# Altium schematic sheet Comms.SchDoc
size A3
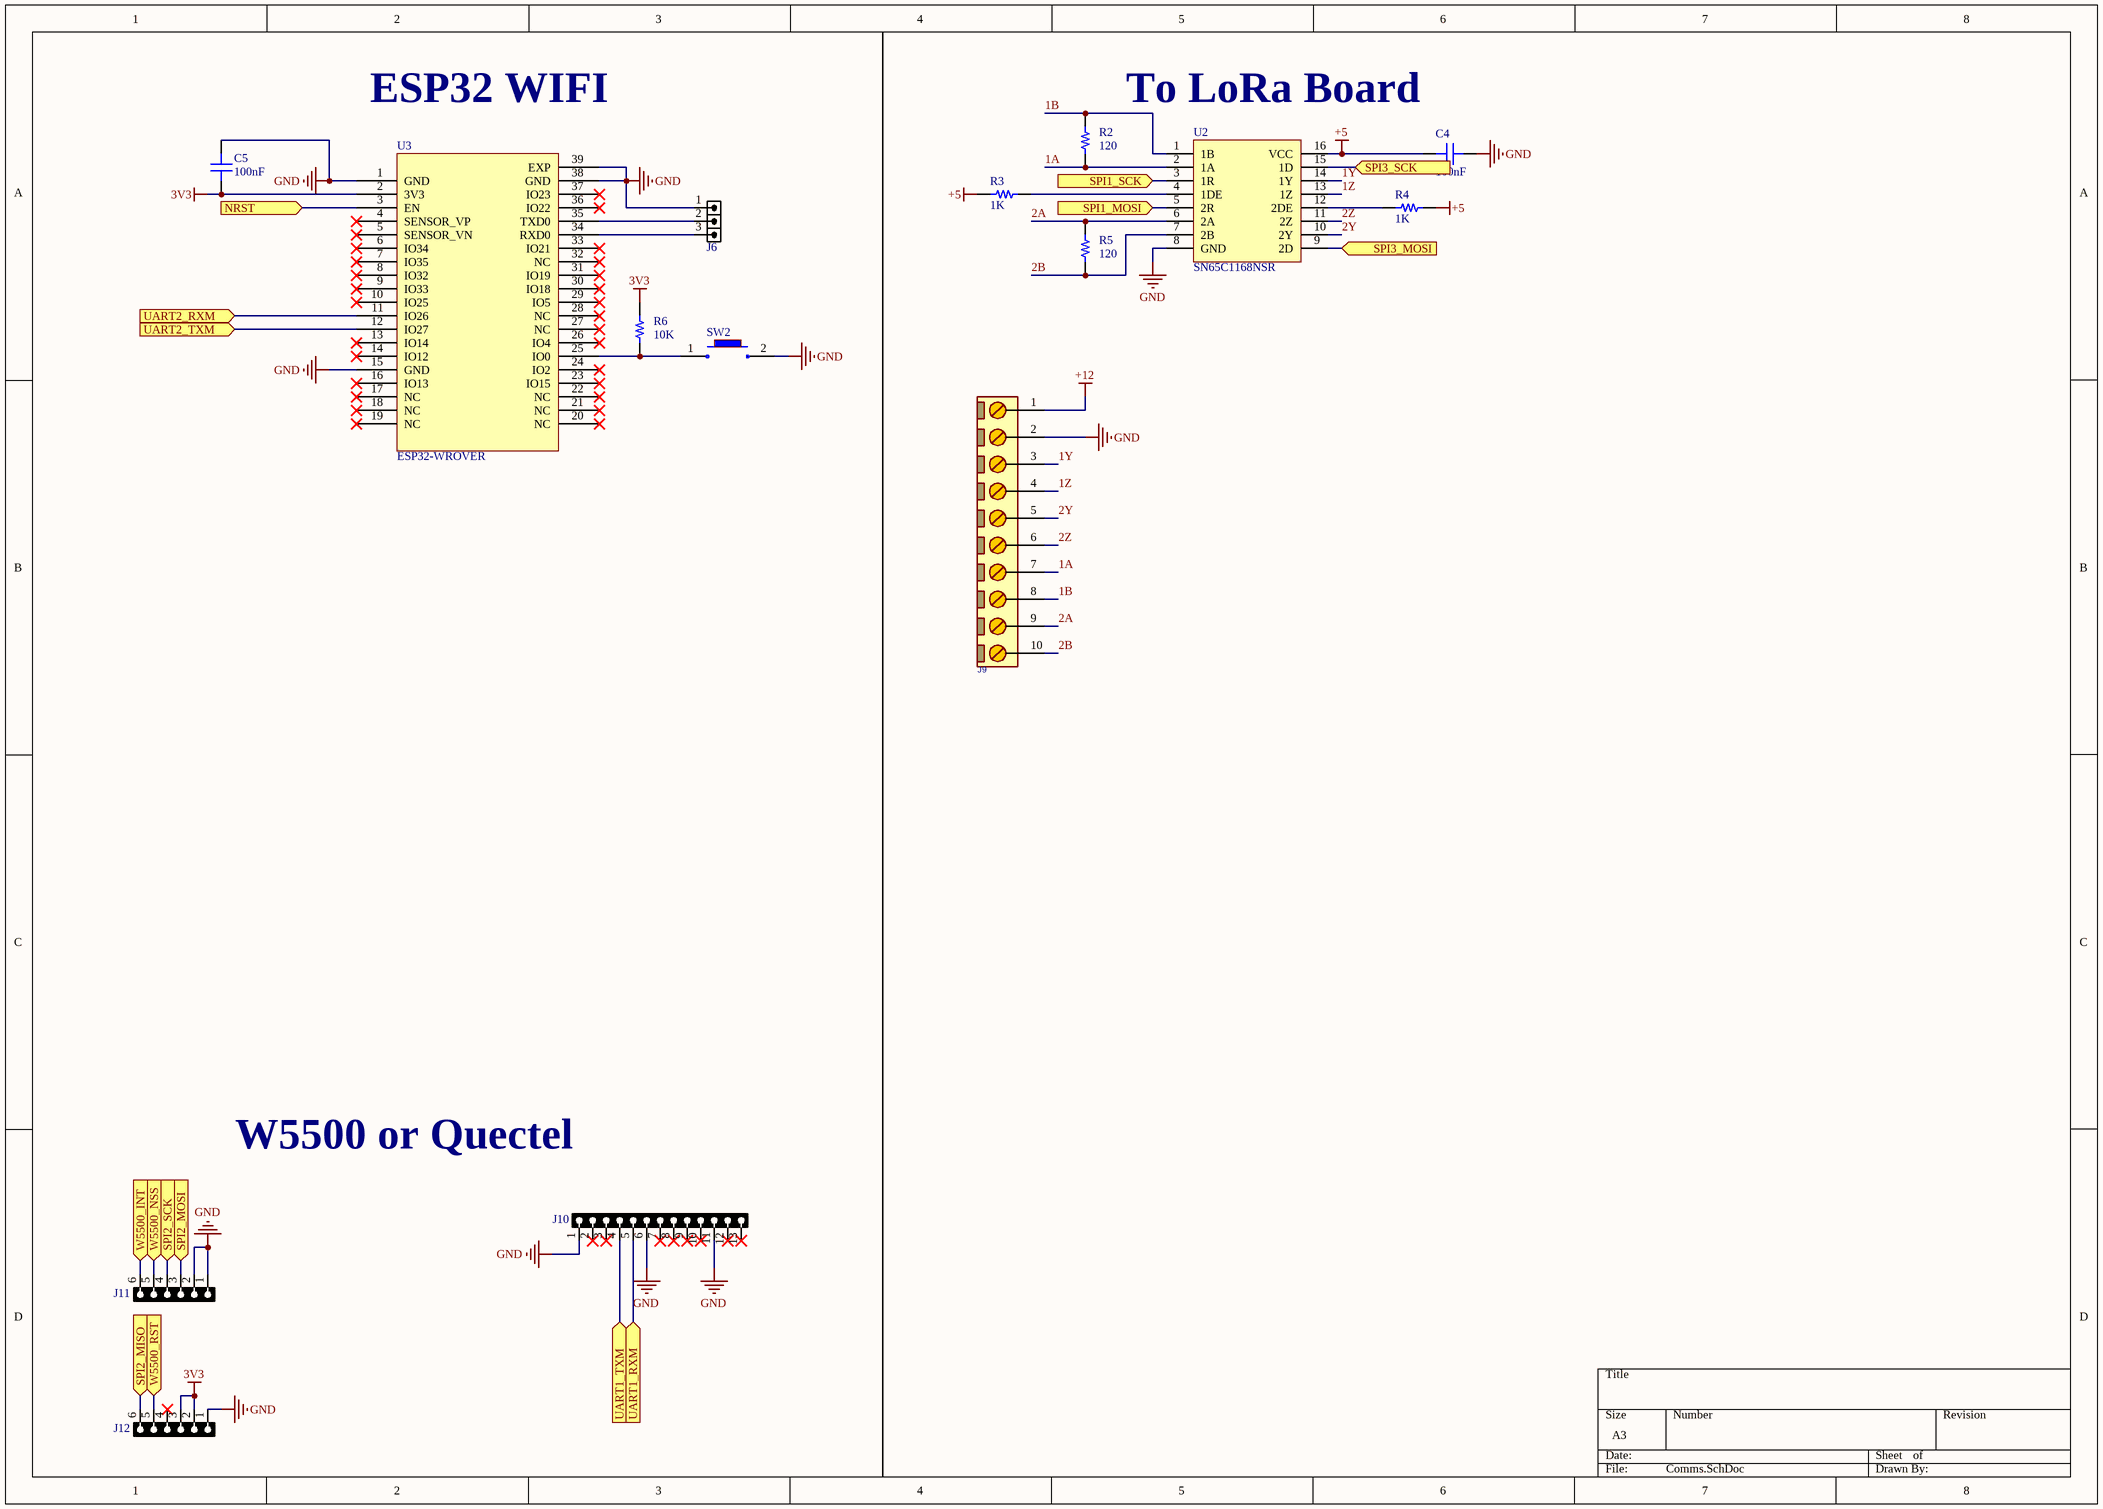
[diagram p0: Comms.SchDoc]

## Parts
C4  100nF  [CAP 0805_2012]
C5  100nF  [CAP 0805_2012]
J6  HDRM3  [HDR_M_1X3]  (value not drawn)
J9  Phoenix MSTB 10Pin  [PHOENIX MSTB_10]  (value not drawn)
J10  HDRF13  [HDR_F_1X13]  (value not drawn)
J11  HDRF6  [HDR_F_1X6]  (value not drawn)
J12  HDRF6  [HDR_F_1X6]  (value not drawn)
R2  120  [RES 0805_2012]
R3  1K  [RES 0805_2012]
R4  1K  [RES 0805_2012]
R5  120  [RES 0805_2012]
R6  10K  [RES 0805_2012]
SW2  Rec. Button  [REC_PUSHBUTTON_FTPRNT]  (value not drawn)
U2  SN65C1168NSR  [SOP16]
U3  ESP32-WROVER  [ESP32_WROVER]

## Ports
NRST (in), SPI1_MOSI (in), SPI1_SCK (in), SPI2_MISO (in), SPI2_MOSI (in), SPI2_SCK (in), SPI3_MOSI (in), SPI3_SCK (in), UART1_RXM (in), UART1_TXM (in), UART2_RXM (in), UART2_TXM (in), W5500_INT (in), W5500_NSS (in), W5500_RST (in)

## Nets
3V3: C5.1 J12.2 J12.3 R6.1 U3.2(3V3)
+5: C4.2 R3.1 R4.2 U2.16(VCC)
+12: J9.1
GND: C4.1 C5.2 J6.1 J9.2 J10.1 J10.6 J10.11 J11.1 J11.2 J12.1 SW2.2 U2.8(GND) U3.1(GND) U3.15(GND) U3.38(GND) U3.39(EXP)
1A: J9.7 R2.2 U2.2(1A)
1B: J9.8 R2.1 U2.1(1B)
1Y: J9.3 U2.14(1Y)
1Z: J9.4 U2.13(1Z)
2A: J9.9 R5.1 U2.6(2A)
2B: J9.10 R5.2 U2.7(2B)
2Y: J9.5 U2.10(2Y)
2Z: J9.6 U2.11(2Z)
NRST: U3.3(EN) ; port NRST
SPI1_MOSI: U2.5(2R) ; port SPI1_MOSI
SPI1_SCK: U2.3(1R) ; port SPI1_SCK
SPI2_MISO: J12.6 ; port SPI2_MISO
SPI2_MOSI: J11.3 ; port SPI2_MOSI
SPI2_SCK: J11.4 ; port SPI2_SCK
SPI3_MOSI: U2.9(2D) ; port SPI3_MOSI
SPI3_SCK: U2.15(1D) ; port SPI3_SCK
UART1_RXM: J10.5 ; port UART1_RXM
UART1_TXM: J10.4 ; port UART1_TXM
UART2_RXM: U3.11(IO26) ; port UART2_RXM
UART2_TXM: U3.12(IO27) ; port UART2_TXM
W5500_INT: J11.6 ; port W5500_INT
W5500_NSS: J11.5 ; port W5500_NSS
W5500_RST: J12.5 ; port W5500_RST
NetJ6_2: J6.2 U3.35(TXD0)
NetJ6_3: J6.3 U3.34(RXD0)
NetR3_2: R3.2 U2.4(1DE)
NetR4_1: R4.1 U2.12(2DE)
NetR6_2: R6.2 SW2.1 U3.25(IO0)

Not connected (* = marked no-connect by the designer): J10 2* 3* 7* 8* 9* 10* 12* 13*; J12 4*; U3 4(SENSOR_VP)* 5(SENSOR_VN)* 6(IO34)* 7(IO35)* 8(IO32)* 9(IO33)* 10(IO25)* 13(IO14)* 14(IO12)* 16(IO13)* 17(NC)* 18(NC)* 19(NC)* 20(NC)* 21(NC)* 22(NC)* 23(IO15)* 24(IO2)* 26(IO4)* 27(NC)* 28(NC)* 29(IO5)* 30(IO18)* 31(IO19)* 32(NC)* 33(IO21)* 36(IO22)* 37(IO23)*

## Notes on the sheet
- ESP32 WIFI
- To LoRa Board
- W5500 or Quectel

## Library data of the parts
C4 C5 = Cap 0805: SMT Capacitor; VALUE: 100nF
J6 = HDR_M_1X3: CONN, HEADER, Male, pitch: 2.54mm, 3POS; VALUE: HDRM3
J9 = Phoenix MSTB 10Pin: CONN, PHOENIX MSTB, 5-G, 5.08mm pitch; PartNumber: MSTB 2,5/10-G-5,08 - 1759091
J10 = HDR_F_1X13: CONN, HEADER, Female, pitch: 2.54mm, 13POS; VALUE: HDRF13
J11 J12 = HDR_F_1X6: CONN, HEADER, Female, pitch: 2.54mm, 6POS; VALUE: HDRF6
R2 R5 R6 = Res 0805: SMT Resistor; VALUE: 1K
R3 R4 = Res 0805: SMT Resistor; VALUE: 1K
SW2 = Rectangle_PushButton
U2 = SN65C1168NSR: SN65C1168 Dual Differential Dri; Manufacturer: Texas Instruments; Number of Receivers: 2; Operating Supply Voltage: 5V; Min Supply Voltage: 4.5V; Max Supply Voltage: 5.5V; Nominal Supply Current: 9mA; Data Rate: 10Mbps; Logic Function: Transceiver,Receiver; Number of Transceivers: 1; Simplex/Duplex: Full Duplex; ESD Protection: No; Supplier 1: Digi-Key; Manufacturer Part Number: SN65C1168NSR; RoHS: Yes; Category: Interface ICs; Pricing 1: 1=3.24000, 10=2.90600, 25=2.74760, 100=2.38120, 250=2.25908, 500=2.02706, 1000=1.72800 (USD); Case/Package: SOP; Number of Pins: 16; Weight: 0.007079oz; Contact Plating: Gold; Min Operating Temperature: -40°C; Max Operating Temperature: 85°C; Number of Transmitters: 2; Packaging: Tape and Reel; Package Quantity: 2000; Number of Drivers: 2; Series: -; Supply Current: 9mA; Operating Supply Current: 9mA; Max Supply Current: 9mA; Lead Free: Lead Free; RoHS Compliant: Yes; ComponentLink1URL: https://datasheet.ciiva.com/6636/sn65c1168-6636522.pdf?src-supplier=Digi-Key; ComponentLink1Description: https://datasheet.ciiva.com/6636/sn65c1168-6636522.pdf?src-supplier=Digi-Key; ComponentLink2URL: https://datasheet.ciiva.com/6636/sn65c1168-6636521.pdf?src-supplier=Digi-Key; ComponentLink2Description: https://datasheet.ciiva.com/6636/sn65c1168-6636521.pdf?src-supplier=Digi-Key; ComponentLink3URL: https://datasheet.ciiva.com/6636/sn65c1168-6636523.pdf?src-supplier=Digi-Key; ComponentLink3Description: https://datasheet.ciiva.com/6636/sn65c1168-6636523.pdf?src-supplier=Digi-Key; ComponentLink4URL: https://datasheet.ciiva.com/14426/slls159f-14426415.pdf?src-supplier=Avnet; ComponentLink4Description: https://datasheet.ciiva.com/14426/slls159f-14426415.pdf?src-supplier=Avnet; Supplier Part Number 1: 296-31716-6-ND
U3 = ESP32-WROVER-E-N16R8: Manufacturer: Espressif Systems; Supplier 1: Digi-Key; Manufacturer Part Number: ESP32-WROVER-E-N16R8; RoHS: No; Category: Uncategorized; Stock 1: 26825; Pricing 1: 1=3.90000 (USD); Supplier Part Number 1: 1965-ESP32-WROVER-E-N16R8CT-ND